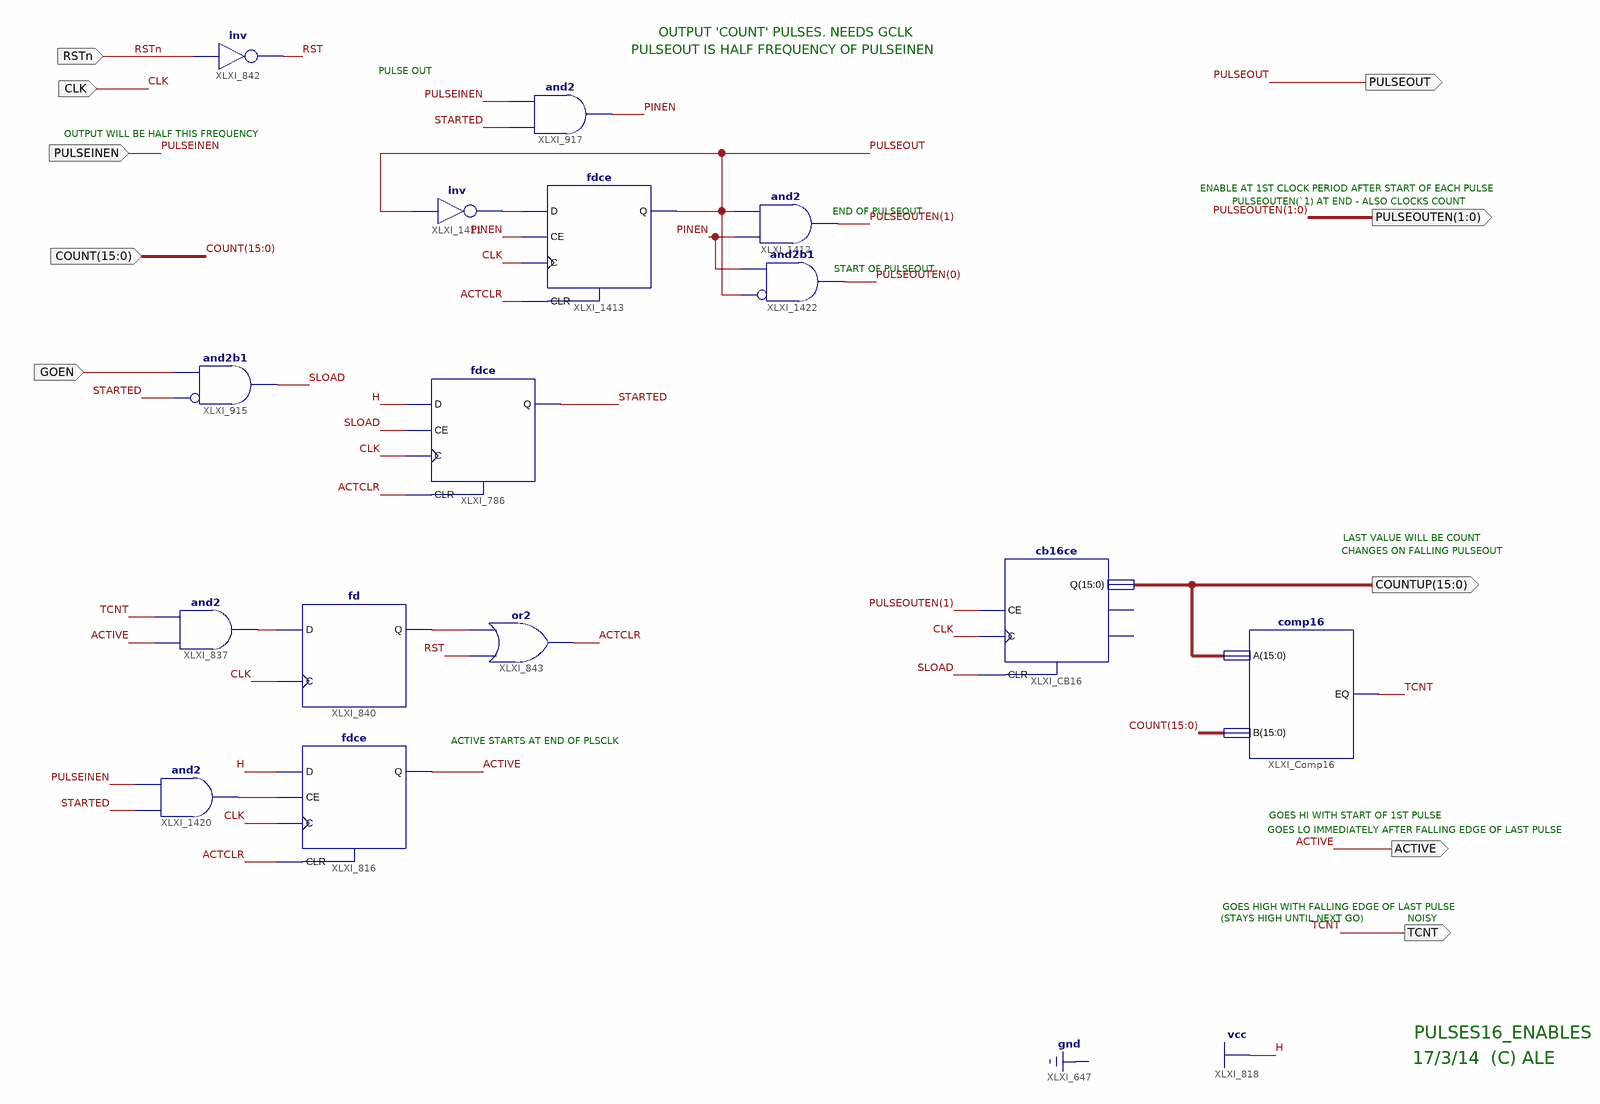
[diagram p0: schematic sheet 1]
// Xilinx ISE schematic Pulses16_Enables.sch (spartan3e) as structural Verilog: 15 symbols, 11 ports
module Pulses16_Enables (
  input  RSTn,
  input  CLK,
  input  [15:0] COUNT,
  input  GOEN,
  input  PULSEINEN,
  output ACTIVE,
  output TCNT,
  output PULSEOUT,
  output [1:0] PULSEOUTEN,
  output [15:0] COUNTUP
);

  wire ACTCLR, PINEN, RST, SLOAD, STARTED, XLXN_46, XLXN_394, XLXN_424, XLXN_611;

  not XLXI_842 (RST, RSTn);
  and XLXI_837 (XLXN_394, ACTIVE, TCNT);
  fdce XLXI_816 (.C(CLK), .CE(XLXN_611), .CLR(ACTCLR), .D(1'b1), .Q(ACTIVE));
  or XLXI_843 (ACTCLR, RST, XLXN_424);
  fd XLXI_840 (.C(CLK), .D(XLXN_394), .Q(XLXN_424));
  fdce XLXI_786 (.C(CLK), .CE(SLOAD), .CLR(ACTCLR), .D(1'b1), .Q(STARTED));
  cb16ce XLXI_CB16 (.C(CLK), .CE(PULSEOUTEN[1]), .CLR(SLOAD), .Q(COUNTUP));  // open: CEO, TC
  comp16 XLXI_Comp16 (.A(COUNTUP), .B(COUNT), .EQ(TCNT));
  and XLXI_915 (SLOAD, ~STARTED, GOEN);  // and2b1
  not XLXI_1411 (XLXN_46, PULSEOUT);
  fdce XLXI_1413 (.C(CLK), .CE(PINEN), .CLR(ACTCLR), .D(XLXN_46), .Q(PULSEOUT));
  and XLXI_917 (PINEN, STARTED, PULSEINEN);
  and XLXI_1412 (PULSEOUTEN[1], PINEN, PULSEOUT);
  and XLXI_1420 (XLXN_611, STARTED, PULSEINEN);
  and XLXI_1422 (PULSEOUTEN[0], ~PULSEOUT, PINEN);  // and2b1

  // Notes on the sheet:
  //   OUTPUT 'COUNT' PULSES. NEEDS GCLK
  //   PULSEOUT IS HALF FREQUENCY OF PULSEINEN
  //   PULSE OUT
  //   OUTPUT WILL BE HALF THIS FREQUENCY
  //   ENABLE AT 1ST CLOCK PERIOD AFTER START OF EACH PULSE
  //   PULSEOUTEN(`1) AT END - ALSO CLOCKS COUNT
  //   END OF PULSEOUT
  //   START OF PULSEOUT
  //   LAST VALUE WILL BE COUNT
  //   CHANGES ON FALLING PULSEOUT
  //   ACTIVE STARTS AT END OF PLSCLK
  //   GOES HI WITH START OF 1ST PULSE
  //   GOES LO IMMEDIATELY AFTER FALLING EDGE OF LAST PULSE
  //   GOES HIGH WITH FALLING EDGE OF LAST PULSE
  //   (STAYS HIGH UNTIL NEXT GO)
  //   NOISY
  //   PULSES16_ENABLES
  //   17/3/14  (C) ALE
endmodule
